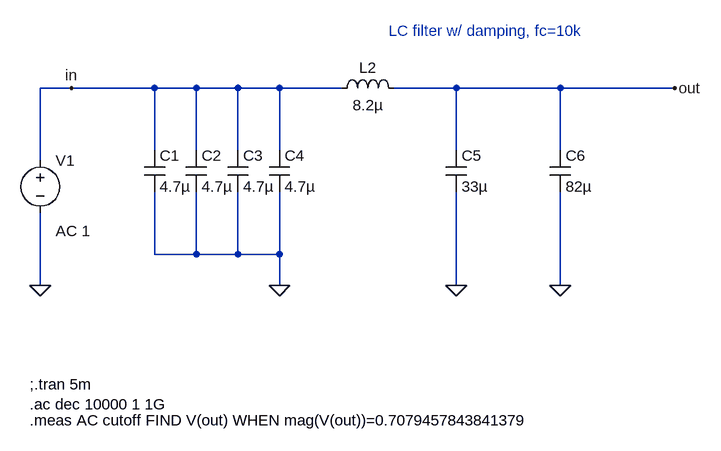
[diagram p0: schematic output_filter.asc]
output_filter.asc, the LTspice schematic file:
Version 4
SHEET 1 1428 680
WIRE 208 64 160 64
WIRE 336 64 208 64
WIRE 400 64 336 64
WIRE 464 64 400 64
WIRE 528 64 464 64
WIRE 624 64 528 64
WIRE 800 64 704 64
WIRE 960 64 800 64
WIRE 1136 64 960 64
WIRE 336 160 336 64
WIRE 400 160 400 64
WIRE 464 160 464 64
WIRE 528 160 528 64
WIRE 800 160 800 64
WIRE 960 160 960 64
WIRE 160 176 160 64
WIRE 336 320 336 224
WIRE 400 320 400 224
WIRE 400 320 336 320
WIRE 464 320 464 224
WIRE 464 320 400 320
WIRE 528 320 528 224
WIRE 528 320 464 320
WIRE 160 368 160 256
WIRE 528 368 528 320
WIRE 800 368 800 224
WIRE 960 368 960 224
FLAG 160 368 0
FLAG 800 368 0
FLAG 1136 64 out
FLAG 208 64 in
FLAG 528 368 0
FLAG 960 368 0
SYMBOL voltage 160 160 R0
WINDOW 3 24 152 Left 2
WINDOW 123 24 124 Left 2
WINDOW 39 24 44 Left 2
SYMATTR Value ""
SYMATTR Value2 AC 1
SYMATTR InstName V1
SYMBOL ind 608 80 R270
WINDOW 0 32 56 VTop 2
WINDOW 3 5 56 VBottom 2
SYMATTR InstName L2
SYMATTR Value 8.2µ
SYMATTR SpiceLine Rser=45m Cpar=0.2p
SYMBOL cap 784 160 R0
SYMATTR InstName C5
SYMATTR Value 33µ
SYMATTR SpiceLine Lser=200p
SYMBOL cap 320 160 R0
SYMATTR InstName C1
SYMATTR Value 4.7µ
SYMATTR SpiceLine Lser=100p
SYMBOL cap 944 160 R0
SYMATTR InstName C6
SYMATTR Value 82µ
SYMATTR SpiceLine Rser=0.5
SYMBOL cap 384 160 R0
SYMATTR InstName C2
SYMATTR Value 4.7µ
SYMATTR SpiceLine Lser=100p
SYMBOL cap 448 160 R0
SYMATTR InstName C3
SYMATTR Value 4.7µ
SYMATTR SpiceLine Lser=100p
SYMBOL cap 512 160 R0
SYMATTR InstName C4
SYMATTR Value 4.7µ
SYMATTR SpiceLine Lser=100p
TEXT 144 520 Left 2 !;.tran 5m\n.ac dec 10000 1 1G
TEXT 696 -24 Left 2 ;LC filter w/ damping, fc=10k
TEXT 144 576 Left 2 !.meas AC cutoff FIND V(out) WHEN mag(V(out))=0.7079457843841379

The netlist it stands for:
* output_filter.asc
V1 in 0 AC 1
L2 in out 8.2µ Rser=45m Cpar=0.2p
C5 out 0 33µ Lser=200p
C1 in 0 4.7µ Lser=100p
C6 out 0 82µ Rser=0.5
C2 in 0 4.7µ Lser=100p
C3 in 0 4.7µ Lser=100p
C4 in 0 4.7µ Lser=100p
;.tran 5m
.ac dec 10000 1 1G
* LC filter w/ damping, fc=10k
.meas AC cutoff FIND V(out) WHEN mag(V(out))=0.7079457843841379
.backanno
.end